# EAGLE design 2wd-power-and-motor (EAGLE 7.7.0)
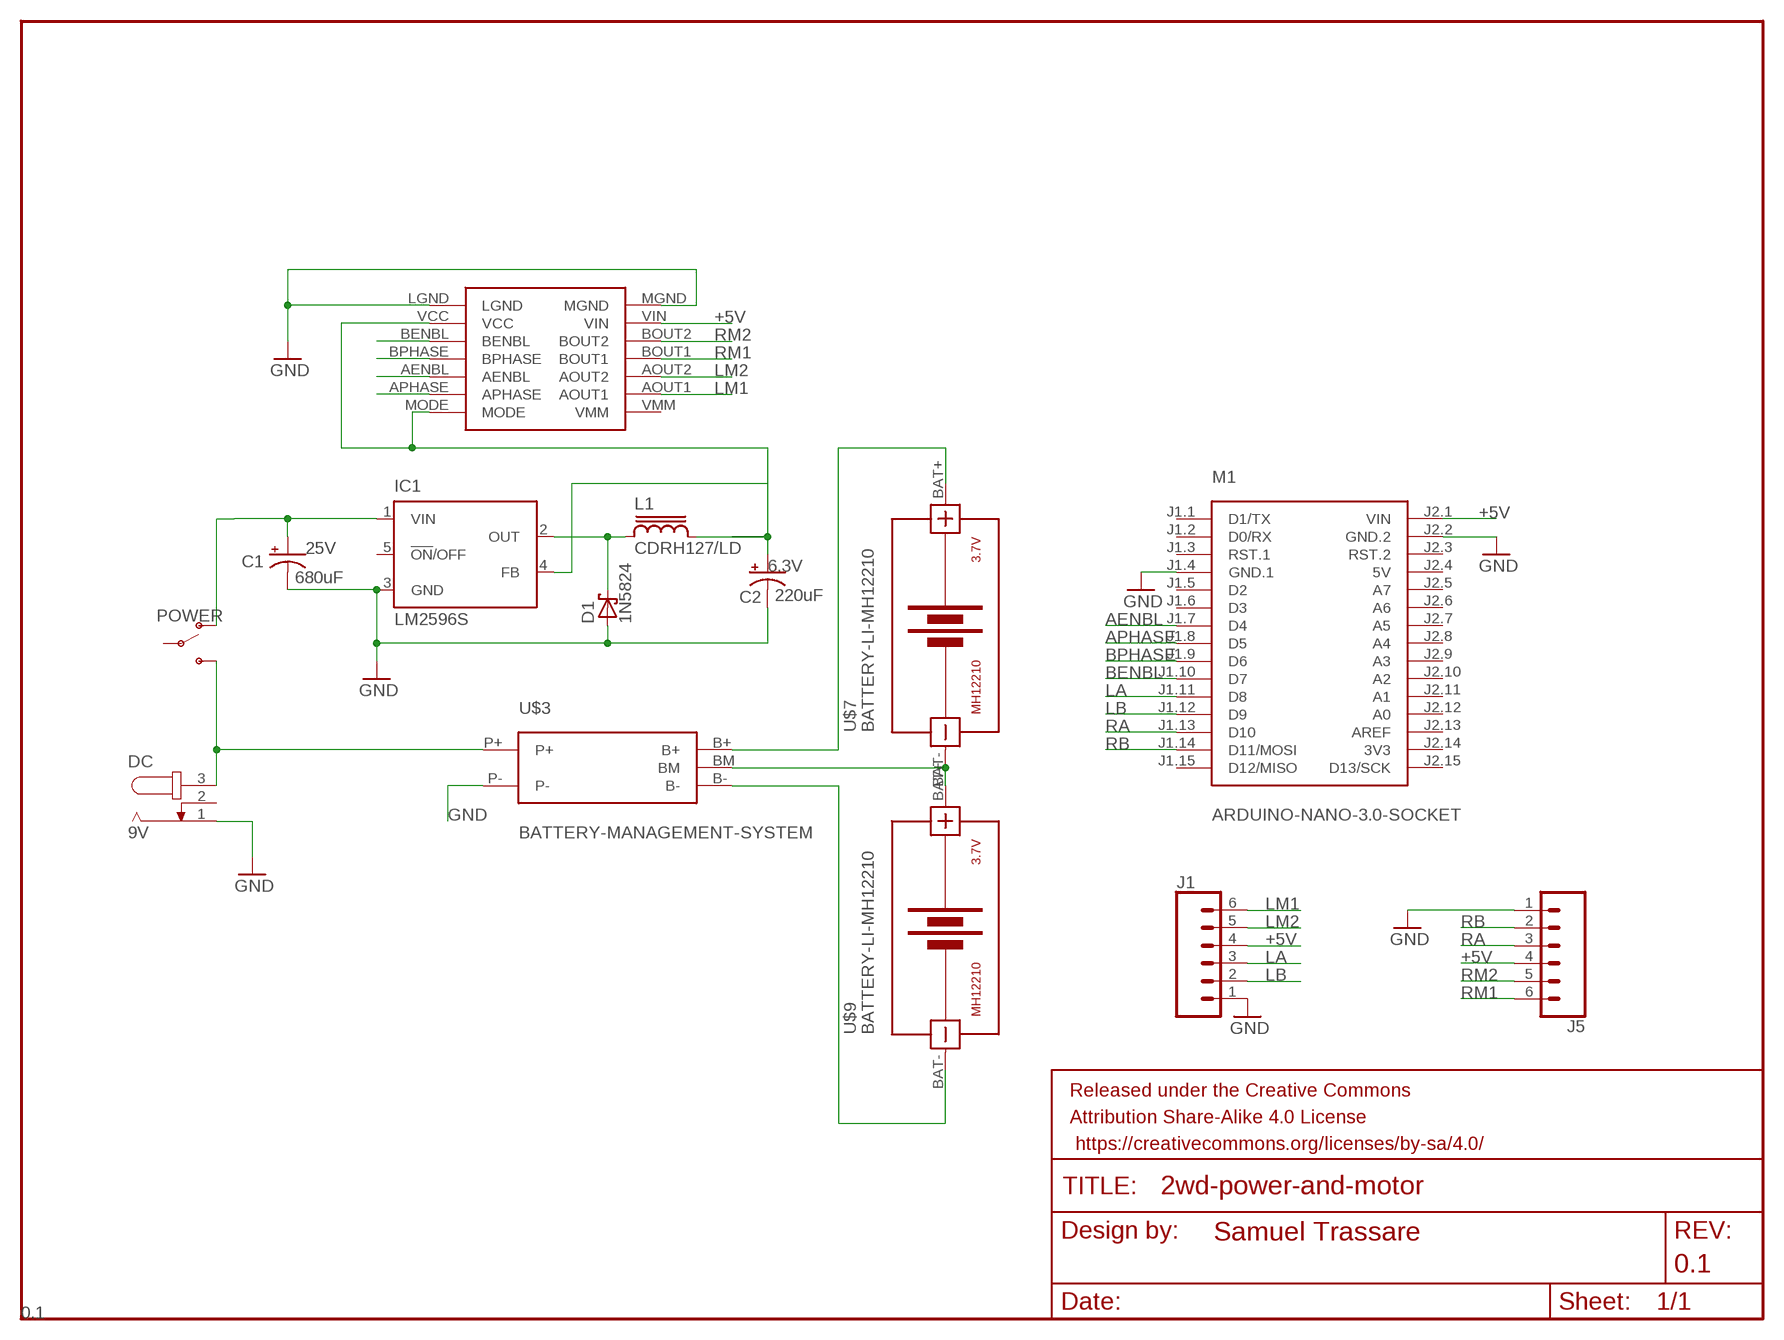
[diagram p0: schematic, sheet 1]

## Parts
C1  680uF  CPOL-USE5-10.5  [E5-10,5]
C2  220uF  CPOL-USUD-6,3X5,8  [UD-6,3X5,8_NICHICON]
D1  1N5824  SCHOTTKY-DIODESMD  [SMB]
DC  9V  JACK-PLUG0  [SPC4077]
FRAME1  FRAME-LETTER  [CREATIVE_COMMONS]
IC1  LM2596S  [TO263-5]
J1  CONN_06LEFT_MOTOR_CONN  [LEFT_MOTOR_CONN]
J5  CONN_06RIGHT_MOTOR_CONN  [RIGHT_MOTOR_CONN]
L1  CDRH127/LD  [CDRH127/LD]
M1  ARDUINO-NANO-3.0-SOCKET  [ARDUINO-NANO-3.0-SOCKET]
POWER  SWITCH-SPDT-PTH-11.6X4.0MM  [SWITCH_SPDT_PTH_11.6X4.0MM]
U$2  POLOLU_MOTOR_DRV8835THROUGHHOLE  [POLOLU_MOTOR_DRV_DRV8835]
U$3  BATTERY-MANAGEMENT-SYSTEM  [BATTERY-MANAGEMENT-SYSTEM]
U$7  BATTERY-LI-MH12210  [BATTERY-LI-MH12210]
U$9  BATTERY-LI-MH12210  [BATTERY-LI-MH12210]

## Nets
+5V: J1.4 J5.4 M1.J2.1(VIN) U$2.VIN
AENBL: M1.J1.7(D4) U$2.AENBL
APHASE: M1.J1.8(D5) U$2.APHASE
BENBL: M1.J1.10(D7) U$2.BENBL
BPHASE: M1.J1.9(D6) U$2.BPHASE
FB: C2.+ IC1.4(FB) L1.2
GND [supply]: C1.- C2.- D1.A DC.1 IC1.3(GND) J1.1 J5.1 M1.J1.4(GND.1) M1.J2.2(GND.2) U$2.LGND U$2.MGND U$3.P-
LA: J1.3 M1.J1.11(D8)
LB: J1.2 M1.J1.12(D9)
LM1: J1.6 U$2.AOUT1
LM2: J1.5 U$2.AOUT2
N$1 [supply]: POWER.1(O)
N$3 [supply]: DC.3 POWER.3(S) U$3.P+
N$4 [supply]: U$3.B+ U$7.BAT+
N$5 [supply]: U$3.B- U$9.BAT-
N$6 [supply]: U$3.BM U$7.BAT- U$9.BAT+
N$10: U$2.MODE U$2.VCC
OUT: D1.C IC1.2(OUT) L1.1
RA: J5.3 M1.J1.13(D10)
RB: J5.2 M1.J1.14(D11/MOSI)
RM1: J5.6 U$2.BOUT1
RM2: J5.5 U$2.BOUT2
VIN1: C1.+ IC1.1(VIN)
Unconnected: DC.2 IC1.5(!ON!/OFF) M1.J1.1(D1/TX) M1.J1.2(D0/RX) M1.J1.3(RST.1) M1.J1.5(D2) M1.J1.6(D3) M1.J1.15(D12/MISO) M1.J2.3(RST.2) M1.J2.5(A7) M1.J2.6(A6) M1.J2.7(A5) M1.J2.8(A4) M1.J2.9(A3) M1.J2.10(A2) M1.J2.11(A1) M1.J2.12(A0) M1.J2.13(AREF) M1.J2.15(D13/SCK) POWER.2(P) U$2.VMM

## Power pins joined to a net without a drawn wire
3V3: M1.J2.14(3V3)
5V: M1.J2.4(5V)

## Library data of the parts
C1 = rcl:CPOL-US: POLARIZED CAPACITOR, American symbol; VOLTAGE: 25V
C2 = rcl:CPOL-US: POLARIZED CAPACITOR, American symbol; VOLTAGE: 6.3V
D1 = diode:SCHOTTKY-DIODE: Schottky Diode
DC = con-jack:JACK-PLUG: DC POWER JACK Power Jack, DC, Right Angle, Through Hole, Rated 5A at 16VDC, PC Terminals Distributor: Farnell (www.Farnell.de) Drawing: 84N1161.pdf / 84N1162.pdf Manufacturer: SPC Technology (www.spctechnology.com) Type: SPC4077 / SPC 4078; OC_FARNELL: unknown; OC_NEWARK: unknown
FRAME1 = SparkFun-Aesthetics:FRAME-LETTER: Schematic Frame - Letter Standard 8.5x11 US Letter frame; DESIGNER: Samuel Trassare; REV: 0.1
IC1 = national-semiconductor:LM2596: SIMPLE SWITCHER® Power Converter 150 kHz 3A Step-Down Voltage Regulator Source: http://www.national.com/ds/LM/LM2596.pdf; MF: NATIONAL SEMICONDUCTOR; MPN: LM2596S-ADJ/NOPB; OC_FARNELL: 9494367; OC_NEWARK: 41K3842
J1 J5 = tiogaplanet:CONN_06: Multi connection point. Often used as Generic Header-pin footprint for 0.1 inch spaced/style header connections On any of the 0.1 inch spaced packages, you can populate with these: Break Away Headers - Straight <https://www.sparkfun.com/products/116> (PRT-00116) Break Away Male Headers - Right Angle <https://www.sparkfun.com/products/553> (PRT-00553) Female Headers <https://www.sparkfun.com/products/115> (PRT-00115) Break Away Headers - Machine Pin <https://www.sparkfun.com/products/117> (PRT-00117) Break Away Female Headers - Swiss Machine Pin <https://www.sparkfun.com/products/743> (PRT-00743) Arduino Stackable Header - 6 Pin <https://www.sparkfun.com/products/9280> (PRT-09280) For SCREWTERMINALS and SPRING TERMINALS visit here: Screw Terimnals on SparkFun.com <https://www.sparkfun.com/search/results?term=Screw+Terminals> (5mm/3.5mm/2.54mm spacing) This device is also useful as a general connection point to wire up your design to another part of your project. Our various solder wires solder well into these plated through hole pads. Hook-Up Wire - Assortment (Stranded, 22 AWG) <https://www.sparkfun.com/products/11375> (PRT-11375) Hook-Up Wire - Assortment (Solid Core, 22 AWG) <https://www.sparkfun.com/products/11367> (PRT-11367) View the entire wire category on our website here <https://www.sparkfun.com/categories/141>
L1 = inductor-sumida:CDRH127/LD: Power Inductor
M1 = tiogaplanet:ARDUINO-NANO-3.0-SOCKET: Arduino Nano socket A socket for the Arduino Nano 3.0 and compatible devices.
POWER = SparkFun-Switches:SWITCH-SPDT: Single Pole, Double Throw (SPDT) Switch Single-pole, double-throw (SPDT) switch. Variant Overview SMD-AYZ0202 Surface Mount DPDT Switch <https://www.sparkfun.com/products/597> (COM-00597) Used on e.g. LilyPad Arduino USB - ATmega32U4 Board <https://www.sparkfun.com/products/12049> PTH-11.6X4.0MM SPDT Mini Power Switch <https://www.sparkfun.com/products/102> (COM-00102) Used on e.g. SparkFun Simon Says - Through-Hole Soldering Kit <https://www.sparkfun.com/products/10547> (KIT-10547) PTH-11.6X4.0MM-KIT KIT version of SPDT Mini Power Switch - Simplifies soldering by removing tStop of switch pins - only one side can be soldered. PTH-11.6X4.0MM-LOCK LOCK version of SPDT Mini Power Switch - Offset pins hold switch in place for easier soldering. SMD-RIGHT-ANGLE Surface Mount Right Angle Switch <https://www.sparkfun.com/products/10860> (COM-10860) Used on e.g. SparkFun ESP8266 Thing <https://www.sparkfun.com/products/13231>; PROD_ID: SWCH-08261; SF_SKU: COM-00102
U$2 = pololu:POLOLU_MOTOR_DRV8835
U$3 = tiogaplanet:BATTERY-MANAGEMENT-SYSTEM
U$7 U$9 = diy-modules:BATTERY-LI-MH12210: Lithium-Ion MH12210 Rechargeable Battery Panasonic NCR18650PF battery datasheet available here: https://industrial.panasonic.com/cdbs/www-data/pdf2/ACI4000/ACI4000C12.pdf Click here to find device on ebay.com <http://www.ebay.com/sch/ncr18650b+battery>

## Net classes
0 default: width 0.508 mm, clearance 0.508 mm
1 supply: width 0.762 mm, clearance 0.762 mm

## Board
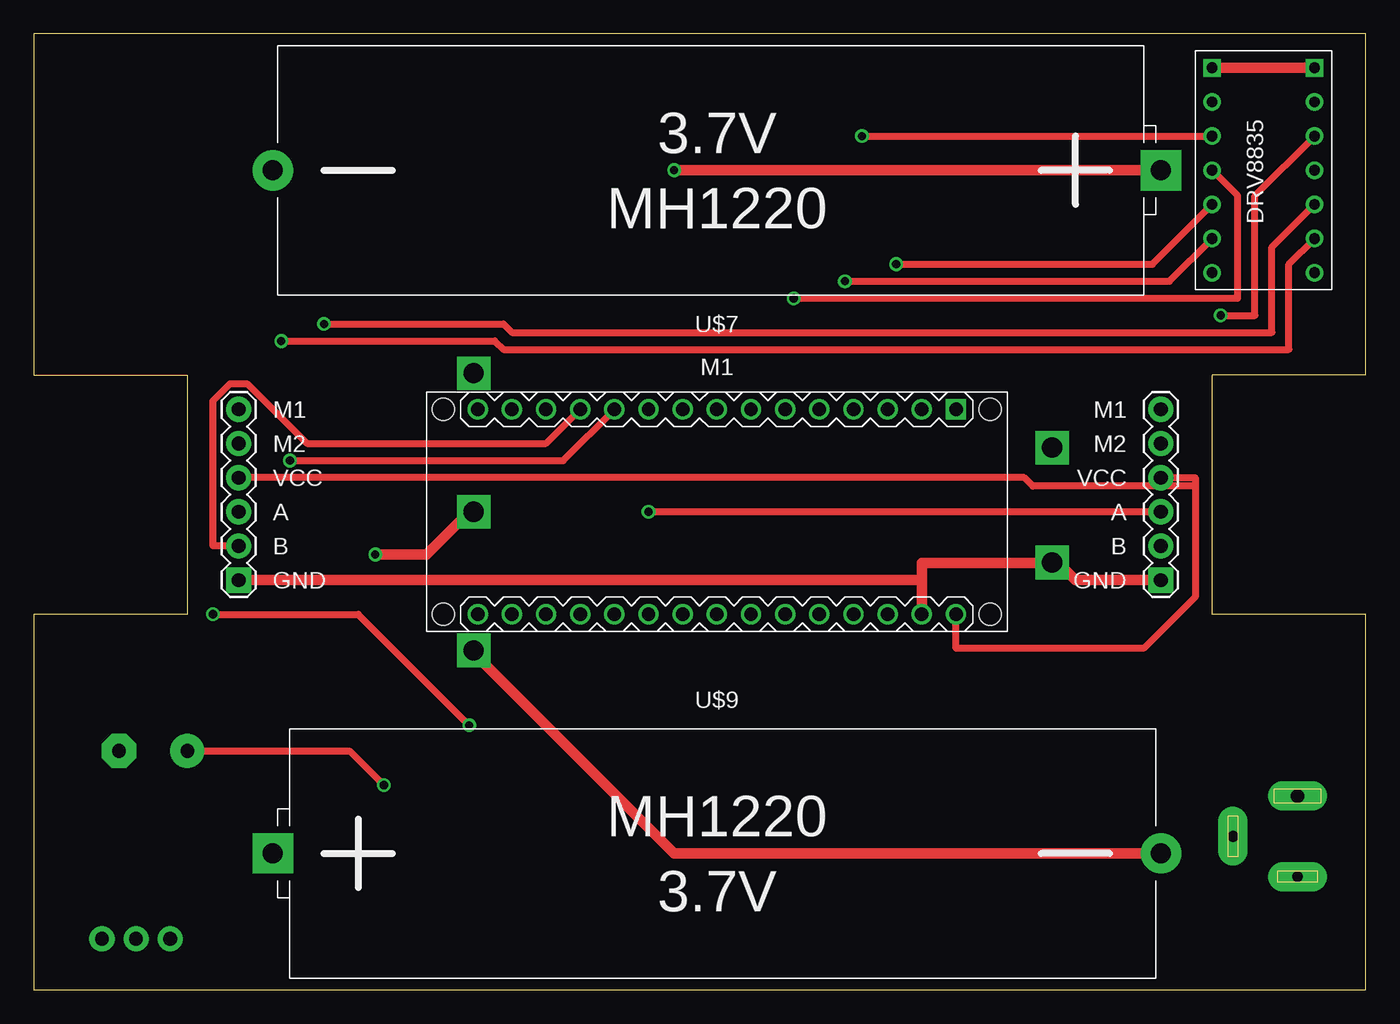
[diagram p1: board, top side]
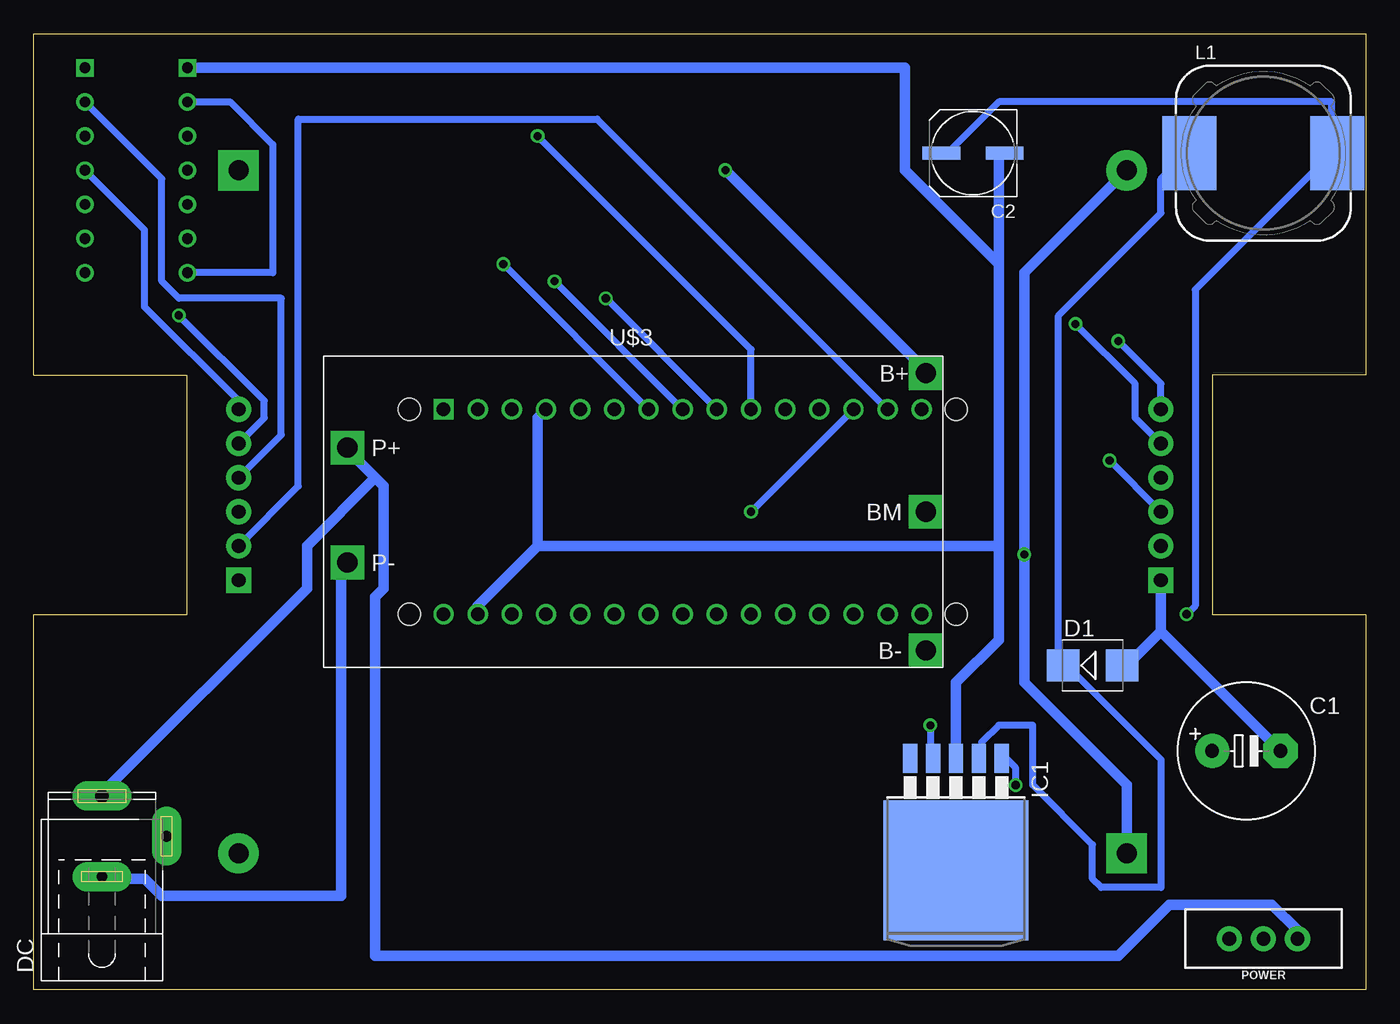
[diagram p2: board, bottom side, seen from below]

Size 99.06 x 71.12 mm. Coordinates in mm from the lower left corner, seen from the top.
Outline: 0,71.11 0,45.72 11.43,45.72 11.43,27.94 0,27.94 0,0 99.06,0 99.06,27.94 87.63,27.94 87.63,45.72 99.06,45.72 99.06,71.11
Outline: 99.06,71.11 99.06,71.12
Outline: 99.06,71.11 0,71.12
Copper layers (1*16): Top 0.035mm / dielectric 1.5mm / Bottom 0.035mm
Design rules "default": minimum track width 10mil, minimum drill 24mil, track to track 8mil, track to pad 8mil, pad to pad 8mil, via to via 8mil, smd to smd 8mil, copper to edge 40mil, drill to drill 8mil, minimum pad ring 10mil, minimum via ring 8mil, stop-mask expansion 4mil, vias tented up to drill 0mil, thermal gap 10mil

### Footprints (pad centres in the part's own frame; a part is rotated, then mirrored left to right if it is on the bottom)
E5-10,5 = drill 1.016 pad 2.54: + -2.54,0 | drill 1.016 pad 2.54 octagon: - 2.54,0
UD-6,3X5,8_NICHICON = smd 2.8 x 1: + 2.35,0; - -2.35,0
SMB = smd 2.4 x 2.4: A 2.2,0; C -2.2,0
SPC4077 = drill 0.8 pad 2.184 long: 1 -3,0; 2 0,-4.8 | drill 1 pad 2.184 long: 3 3,0
TO263-5 = smd 1.067 x 2.159: 1 -3.404,-5.791; 2 -1.702,-5.791; 3 0,-5.791; 4 1.702,-5.791; 5 3.404,-5.791 | smd 10.8 x 10.41: 6 0,2.54
LEFT_MOTOR_CONN = drill 1.016 pad 1.88 square: 1 0,-6.35 | drill 1.016 pad 1.88: 2 0,-3.81; 3 0,-1.27; 4 0,1.27; 5 0,3.81; 6 0,6.35
RIGHT_MOTOR_CONN = drill 1.016 pad 1.88 square: 1 0,-6.35 | drill 1.016 pad 1.88: 2 0,-3.81; 3 0,-1.27; 4 0,1.27; 5 0,3.81; 6 0,6.35
CDRH127/LD = smd 4 x 5.5: 1 -5.5,0; 2 5.5,0
ARDUINO-NANO-3.0-SOCKET = drill 1 square: J1.1 17.78,7.62 | drill 1: J1.2 15.24,7.62; J1.3 12.7,7.62; J1.4 10.16,7.62; J1.5 7.62,7.62; J1.6 5.08,7.62; J1.7 2.54,7.62; J1.8 0,7.62; J1.9 -2.54,7.62; J1.10 -5.08,7.62; J1.11 -7.62,7.62; J1.12 -10.16,7.62; J1.13 -12.7,7.62; J1.14 -15.24,7.62; J1.15 -17.78,7.62; J2.1 17.78,-7.62; J2.2 15.24,-7.62; J2.3 12.7,-7.62; J2.4 10.16,-7.62; J2.5 7.62,-7.62; J2.6 5.08,-7.62; J2.7 2.54,-7.62; J2.8 0,-7.62; J2.9 -2.54,-7.62; J2.10 -5.08,-7.62; J2.11 -7.62,-7.62; J2.12 -10.16,-7.62; J2.13 -12.7,-7.62; J2.14 -15.24,-7.62; J2.15 -17.78,-7.62 | hole 1.651: -20.32,7.62; -20.32,-7.62; 20.32,-7.62; 20.32,7.62
SWITCH_SPDT_PTH_11.6X4.0MM = drill 1.016 pad 1.88: 1 0,2.54; 2 0,0; 3 0,-2.54
POLOLU_MOTOR_DRV_DRV8835 = drill 0.8: AENBL 1.27,6.35; AOUT1 8.89,3.81; AOUT2 8.89,6.35; APHASE 1.27,3.81; BENBL 1.27,11.43; BOUT1 8.89,8.89; BOUT2 8.89,11.43; BPHASE 1.27,8.89; MODE 1.27,1.27; VCC 1.27,13.97; VIN 8.89,13.97; VMM 8.89,1.27 | drill 0.8 square: LGND 1.27,16.51; MGND 8.89,16.51
BATTERY-MANAGEMENT-SYSTEM = drill 1.5 pad 2.5 square: B+ 21.89,10.31; B- 21.89,-10.31; BM 21.89,0; P+ -21.12,4.77; P- -21.12,-3.77
BATTERY-LI-MH12210 = drill 1.5 pad 3 square: BAT+ -33.02,0 | drill 1.5 pad 3: BAT- 33.02,0

### Placement (x,y rotation side)
C1  8.89,17.78 0 bottom
C2  29.21,62.23 180 bottom
D1  20.32,24.13 0 bottom
DC  93.98,11.43 90 bottom
FRAME1  17.78,-10.16 0 top  (outside the outline)
IC1  30.48,11.43 180 bottom
J1  15.24,36.83 0 top
J5  83.82,36.83 0 top
L1  7.62,62.23 0 bottom
M1  50.8,35.56 0 top
POWER  7.62,3.81 90 bottom
U$2  86.36,52.07 0 top
U$3  54.61,35.56 0 bottom
U$7  50.8,60.96 180 top
U$9  50.8,10.16 0 top

### Tracks (layer width: path | path; a pad name or v marks a point on that pad's centre or on a via)
+5V
  Top 0.508: M1.J2.1 68.58,25.4 82.55,25.4 86.36,29.21 86.36,37.47 | 86.36,37.47 86.36,38.1 J5.4 | J1.4 73.66,38.1 74.3,37.47 86.36,37.47
  Bottom 0.508: U$2.VIN 89.53,60.33 89.53,52.7 88.27,51.44 80.64,51.44 80.64,41.27 J5.4
AENBL  (via drill 0.61)
  Top 0.508: U$2.AENBL 83.19,53.98 v64.14,53.98
  Bottom 0.508: M1.J1.7 v64.14,53.98
APHASE  (via drill 0.61)
  Top 0.508: U$2.APHASE 84.45,52.7 v60.33,52.7
  Bottom 0.508: M1.J1.8 v60.33,52.7
BENBL  (via drill 0.61)
  Top 0.508: v61.59,63.5 U$2.BENBL
  Bottom 0.508: v61.59,63.5 45.72,47.62 M1.J1.10
BPHASE  (via drill 0.61)
  Top 0.508: U$2.BPHASE 89.53,59.05 89.53,51.44 v56.52,51.44
  Bottom 0.508: M1.J1.9 v56.52,51.44
FB  (via drill 0.61)
  Top 0.508: v32.38,19.68 24.13,27.94 v13.34,27.94
  Bottom 0.508: v32.38,19.68 32.38,17.78 IC1.4 | v13.34,27.94 12.7,28.57 12.7,52.07 2.54,62.23 | 2.54,62.23 2.54,66.04 27.3,66.04 31.11,62.23 C2.+ | 2.54,62.23 L1.2
GND
  Top 0.762: U$2.MGND U$2.LGND | 66.04,30.48 66.04,31.75 75.56,31.75 U$3.P- 76.2,31.75 77.47,30.48 J5.1 | 66.04,30.48 M1.J2.2 | 66.04,30.48 J1.1
  Bottom 0.762: IC1.3 30.48,22.86 27.3,26.04 27.3,33.02 | 27.3,53.98 27.3,62.23 C2.- | 27.3,53.98 27.3,33.02 | U$2.LGND 34.29,68.58 34.29,60.96 27.3,53.98 | 15.24,26.67 17.78,24.13 D1.A | J1.1 15.24,26.67 | 15.24,26.67 C1.- | M1.J1.4 61.59,42.55 61.59,33.02 | 61.59,33.02 66.04,28.57 M1.J2.2 | DC.1 93.98,8.26 90.81,8.26 89.53,6.99 76.2,6.99 76.2,31.75 U$3.P- | 61.59,33.02 27.3,33.02
LA  (via drill 0.61)
  Top 0.508: M1.J1.11 39.37,39.37 v19.05,39.37
  Bottom 0.508: J1.3 v19.05,39.37
LB
  Top 0.508: M1.J1.12 38.1,40.64 20.32,40.64 15.88,45.09 14.61,45.09 13.34,43.81 13.34,33.02 J1.2
LM1  (via drill 0.61)
  Top 0.508: U$2.AOUT1 93.34,53.98 93.34,47.62 34.92,47.62 34.29,48.26 v18.41,48.26
  Bottom 0.508: v18.41,48.26 15.24,45.09 J1.6
LM2  (via drill 0.61)
  Top 0.508: U$2.AOUT2 92.08,55.24 92.08,48.9 35.56,48.9 34.92,49.53 v21.59,49.53
  Bottom 0.508: v21.59,49.53 17.14,45.09 17.14,42.55 J1.5
N$3
  Bottom 0.762: POWER.3 5.08,4.45 6.99,6.35 14.61,6.35 18.41,2.54 73.66,2.54 73.66,29.21 73.03,29.84 73.03,37.47 73.66,38.1 | 73.66,38.1 75.56,40.01 U$3.P+ | 73.66,38.1 78.74,33.02 78.74,29.84 93.98,14.61 DC.3
N$4  (via drill 0.61)
  Top 0.762: U$7.BAT+ v47.62,60.96
  Bottom 0.762: v47.62,60.96 33.02,46.35 U$3.B+
N$5
  Top 0.762: U$9.BAT- 47.62,10.16 33.02,24.77 U$3.B-
N$6  (via drill 0.61)
  Top 0.762: v25.4,32.38 29.21,32.38 32.38,35.56 U$3.BM
  Bottom 0.762: U$9.BAT+ 17.78,15.24 25.4,22.86 v25.4,32.38 25.4,53.34 U$7.BAT-
N$10
  Bottom 0.508: U$2.MODE 81.28,53.34 81.28,62.87 84.45,66.04 U$2.VCC
OUT
  Bottom 0.508: IC1.2 28.57,17.78 28.57,18.41 27.3,19.68 24.77,19.68 24.77,15.24 20.32,10.79 20.32,8.26 19.68,7.62 15.24,7.62 15.24,17.14 22.23,24.13 D1.C 22.86,24.13 22.86,50.16 15.24,57.78 15.24,60.33 13.34,62.23 L1.1
RA  (via drill 0.61)
  Top 0.508: J5.3 v45.72,35.56
  Bottom 0.508: v45.72,35.56 M1.J1.13
RB
  Bottom 0.508: M1.J1.14 57.15,64.77 79.38,64.77 79.38,37.47 J5.2
RM1
  Bottom 0.508: U$2.BOUT1 90.81,56.52 90.81,50.8 83.82,43.81 J5.6
RM2  (via drill 0.61)
  Top 0.508: U$2.BOUT2 90.81,59.05 90.81,50.16 v88.27,50.16
  Bottom 0.508: v88.27,50.16 81.92,43.81 81.92,42.55 J5.5
VIN1  (via drill 0.61)
  Top 0.508: v26.04,15.24 23.5,17.78 C1.+
  Bottom 0.508: v26.04,15.24 26.04,16.51 26.67,17.14 IC1.1